# Altium schematic sheet Feuille_2_ESP32.SchDoc
size A4; SheetNumber: 1; SheetTotal: 7
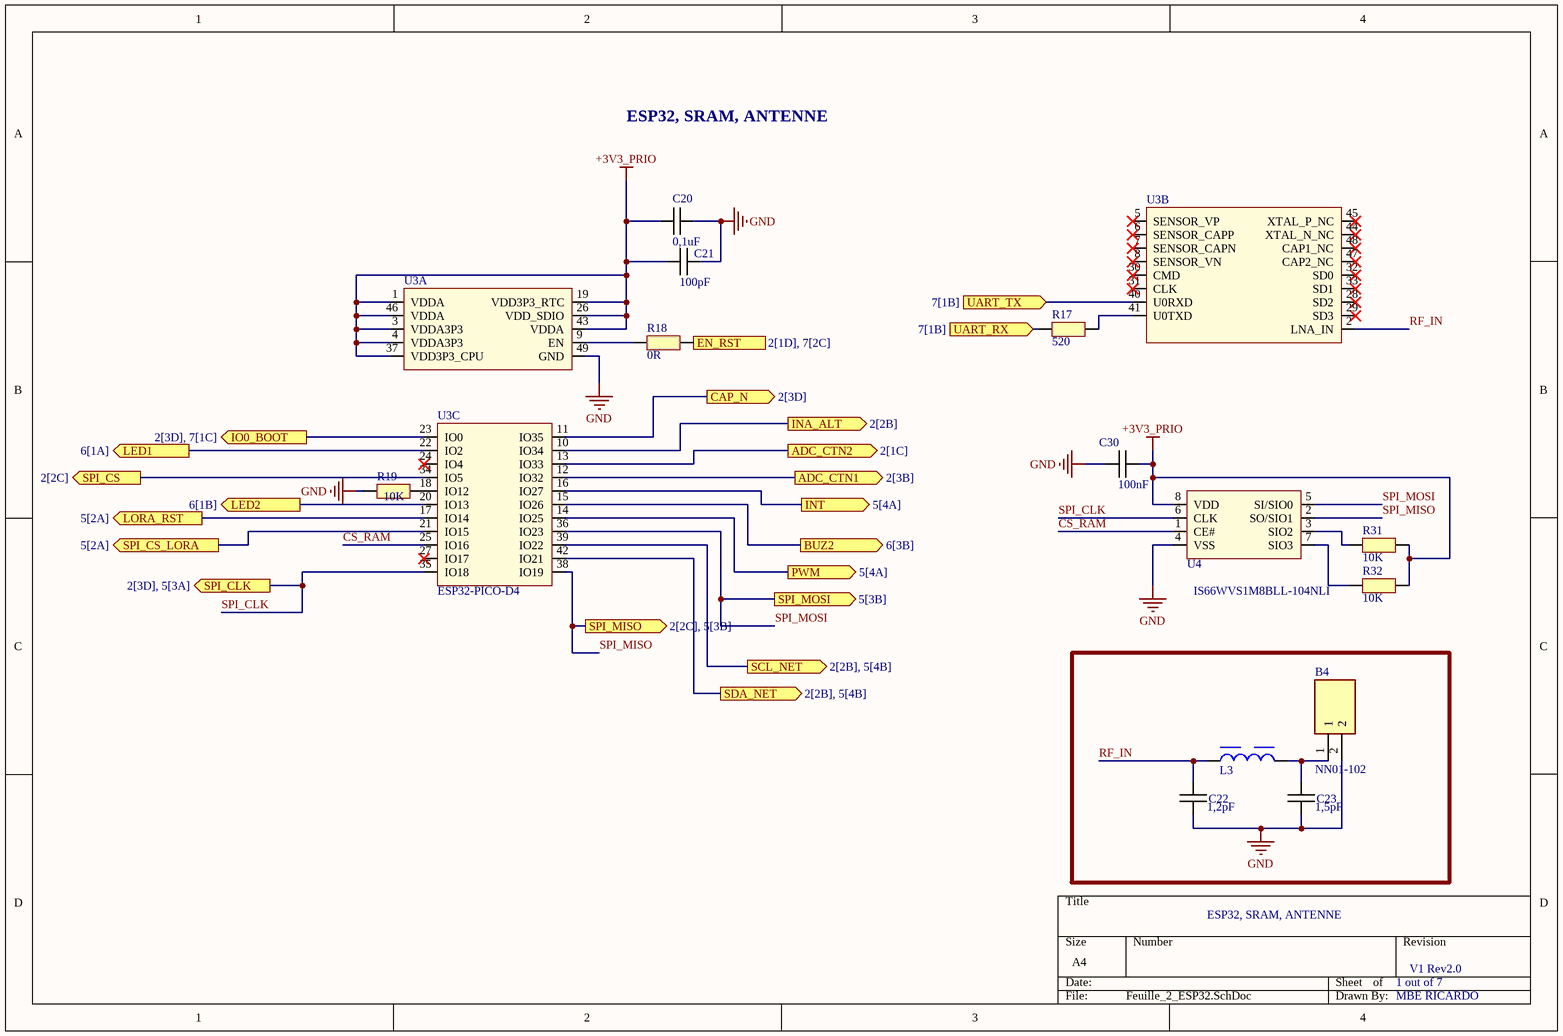
[diagram p0: Feuille_2_ESP32.SchDoc]

## Parts
B4  NN01-102  [NN01-102]
C20  0,1uF  [CAPC1005X06N]
C21  100pF  [CAPC1005X06N]
C22  1,2pF  [CAPC1005X06N]
C23  1,5pF  [CAPC1005X06N]
C30  100nF  [CAPC1005X06N]
L3  3.3uH, 3.5A  [WE-LHMI_4020]  (value not drawn)
R17  520  [RESC1005X06N]
R18  0R  [RESC1005X06N]
R19  10K  [RESC1005X06N]
R31  10K  [RESC1005X06N]
R32  10K  [RESC1005X06N]
U3  ESP32-PICO-D4  [PQFN50P700X700X104_HS-49N]  (value not drawn)  (parts A,B,C of 3)
U4  IS66WVS1M8BLL-104NLI  [SOIC127P600X175-8N]

## Ports
ADC_CTN1 (out, see 2[3B]), ADC_CTN2 (out, see 2[1C]), BUZ2 (out, see 6[3B]), CAP_N (out, see 2[3D]), EN_RST (out, see 2[1D], 7[2C]), INA_ALT (out, see 2[2B]), INT (out, see 5[4A]), IO0_BOOT (out, see 2[3D], 7[1C]), LED1 (out, see 6[1A]), LED2 (out, see 6[1B]), LORA_RST (out, see 5[2A]), PWM (out, see 5[4A]), SCL_NET (out, see 2[2B], 5[4B]), SDA_NET (out, see 2[2B], 5[4B]), SPI_CLK (out, see 2[3D], 5[3A]), SPI_CS (out, see 2[2C]), SPI_CS_LORA (out, see 5[2A]), SPI_MISO (out, see 2[2C], 5[3B]), SPI_MOSI (out, see 5[3B]), UART_RX (in, see 7[1B]), UART_TX (in, see 7[1B])

## Nets
+3V3_PRIO: C20.1 C21.2 C30.2 R31.1 R32.1 U3.1(VDDA) U3.3(VDDA3P3) U3.4(VDDA3P3) U3.19(VDD3P3_RTC) U3.26(VDD_SDIO) U3.37(VDD3P3_CPU) U3.43(VDDA) U3.46(VDDA) U4.8(VDD)
GND: B4.2 C20.2 C21.1 C22.2 C23.2 C30.1 R19.2 U3.49(GND) U4.4(VSS)
ADC_CTN1: U3.12(IO32) ; port ADC_CTN1
ADC_CTN2: U3.13(IO33) ; port ADC_CTN2
BUZ2: U3.15(IO26) ; port BUZ2
CAP_N: U3.11(IO35) ; port CAP_N
CS_RAM: U3.25(IO16) U4.1(CE#)
EN_RST: R18.1 ; port EN_RST
INA_ALT: U3.10(IO34) ; port INA_ALT
INT: U3.16(IO27) ; port INT
IO0_BOOT: U3.23(IO0) ; port IO0_BOOT
LED1: U3.22(IO2) ; port LED1
LED2: U3.20(IO13) ; port LED2
LORA_RST: U3.17(IO14) ; port LORA_RST
PWM: U3.14(IO25) ; port PWM
RF_IN: C22.1 L3.1 U3.2(LNA_IN)
SCL_NET: U3.39(IO22) ; port SCL_NET
SDA_NET: U3.42(IO21) ; port SDA_NET
SPI_CLK: U3.35(IO18) U4.6(CLK) ; port SPI_CLK
SPI_CS: U3.34(IO5) ; port SPI_CS
SPI_CS_LORA: U3.21(IO15) ; port SPI_CS_LORA
SPI_MISO: U3.38(IO19) U4.2(SO/SIO1) ; port SPI_MISO
SPI_MOSI: U3.36(IO23) U4.5(SI/SIO0) ; port SPI_MOSI
UART_RX: R17.2 ; port UART_RX
UART_TX: U3.40(U0RXD) ; port UART_TX
NetB4_1: B4.1 C23.1 L3.2
NetR17_1: R17.1 U3.41(U0TXD)
NetR18_2: R18.2 U3.9(EN)
NetR19_1: R19.1 U3.18(IO12)
NetR31_2: R31.2 U4.3(SIO2)
NetR32_2: R32.2 U4.7(SIO3)

Not connected (* = marked no-connect by the designer): U3 5(SENSOR_VP)* 6(SENSOR_CAPP)* 7(SENSOR_CAPN)* 8(SENSOR_VN)* 24(IO4)* 27(IO17)* 28(SD2)* 29(SD3)* 30(CMD)* 31(CLK)* 32(SD0)* 33(SD1)* 44(XTAL_N_NC)* 45(XTAL_P_NC)* 47(CAP2_NC)* 48(CAP1_NC)*

## Notes on the sheet
- ESP32, SRAM, ANTENNE
- 1 out of 7
- V1 Rev2.0
- MBE RICARDO

## Library data of the parts
B4 = NN01-102: Antennes Compact Reach Xtend 2.4 GHz
C20-C23 C30 = Capacitor
L3 = 74437324033: WE-LHMI SMT Power Inductor, size 4020, 3.3uH, 3.5A, 76mOhm; Manufacturer: Wurth Elektronik; Case/Size Code: 4020; DC Resistance: 69mOhm; Saturation Current @ 10%: 2.75A; Saturation Current @ 30%: 5.45A; Self Resonant Frequency: 40MHz; Manufacturer Part Number: 74437324033; Category: Power Inductors; Match Code: WE-LHMI; ComponentLink1Description: Website Link; ComponentLink1URL: https://www.we-online.com/redexpert/article/74437324033?ad; ComponentLink2Description: Datasheet Link; ComponentLink2URL: https://www.we-online.com/redexpert/spec/74437324033?ad; Mount: Surface Mount; Operating Temperature Max: 125°C; Operating Temperature Min: -40°C; Packaging: Tape and Reel; Length: 4.06mm; Width: 4.06mm; Height: 1.8mm; DC Resistance Max: 76mOhm; Inductance: 3.3uH; Performance Rated Current: 3.5A
R17-R19 R31 R32 = Resistor
U3 = ESP32: Système RF sur puce - SoC SIP module ESP32 with 4MByte Flash, Dual Core MCU, Wi-Fi & Bluetooth Combo, LGA48-pin, 7*7mm; Manufacturer 1: Espressif Systems; Supplier 1: Digi-Key; Supplier Part Number 1: 1904-1029-1-ND; Manufacturer Part Number 1: ESP32-PICO-D4
U4 = SRAM: SRAM 8Mb, SerialRAM, 2.7V-3.6V, 104MHz, 8 pin SOIC 150 mil, RoHS; Manufacturer 1: ISSI; Supplier 1: Digi-Key; Supplier Part Number 1: 706-IS66WVS1M8BLL-104NLI-ND; Manufactuer Part Number 1: IS66WVS1M8BLL-104NLI